# Altium schematic sheet PWR.SchDoc
size A; SheetNumber: 4; SheetTotal: 6
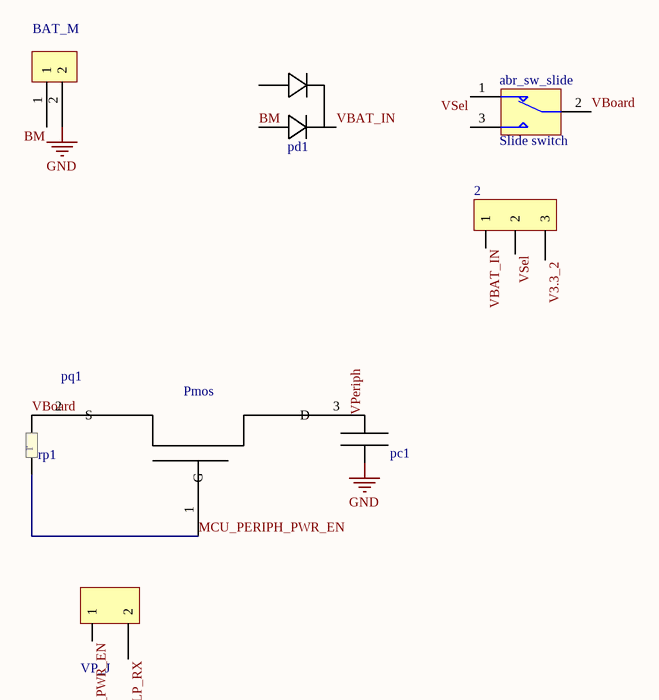
[diagram p0: PWR.SchDoc]

## Parts
2  pin header 2mm  [abr_ph_3x1_2mm_2d_male]  (value not drawn)
abr_sw_slide  Slide switch  [abr_sw_slide__r_3d]
BAT_M  YB2 SMD  [abr_sw_yb_2p_3d]  (value not drawn)
pc1  100nf  [abr_cap_0805_3d]  (value not drawn)
pd1  abr_diode_shotkey  [abr_diode_bat54c_3d]  (value not drawn)
pq1  irlm6402  [irlm6402]  (value not drawn)
rp1  100k  [abr_res_0805_3d]  (value not drawn)
VP_J  pin header 2mm  [abr_ph_2x1_2mm_3d_male]  (value not drawn)

## Nets
GND: BAT_M.2 pc1.1
BM: BAT_M.1 pd1.2
MCU_PERIPH_PWR_EN: pq1.1(G) rp1.0 VP_J.1
MCULP_RX: VP_J.2
V3.3_2: 2.3
VBAT_IN: 2.1 pd1.3
VBoard: abr_sw_slide.2 pq1.2(S) rp1.1
VPeriph: pc1.0 pq1.3(D)
VSel: 2.2 abr_sw_slide.1

Not connected (* = marked no-connect by the designer): abr_sw_slide 3; pd1 1(4)

## Notes on the sheet
- (in symbol abr_res_0805) r
- (in symbol irlm6402) Pmos

## Library data of the parts
2 = abr_ph_3x1_2mm
pc1 = abr_cap_0805
pd1 = abr_diode_shatkey_bat54c
rp1 = abr_res_0805
VP_J = abr_2x1_2mm